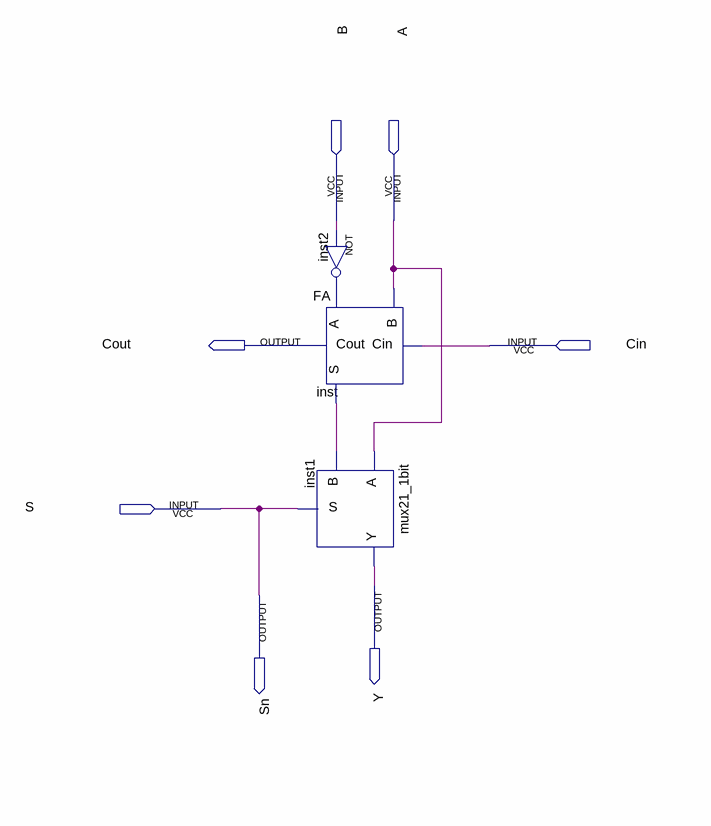
[diagram p0: schematic sheet]
// Quartus schematic unit.bdf as structural Verilog: 3 symbols, 7 pins
module unit (
  input  B,
  input  A,
  input  Cin,
  input  S,
  output Cout,
  output Y,
  output Sn
);

  wire inst2_out, inst_s;

  not inst2 (inst2_out, B);
  FA inst (.A(inst2_out), .B(A), .Cin(Cin), .S(inst_s), .Cout(Cout));
  mux21_1bit inst1 (.A(A), .B(inst_s), .S(S), .Y(Y));

  assign Sn = S;
endmodule
